# Altium schematic sheet Sheet2.SchDoc
size A2; DrawnBy: Sergiy_83
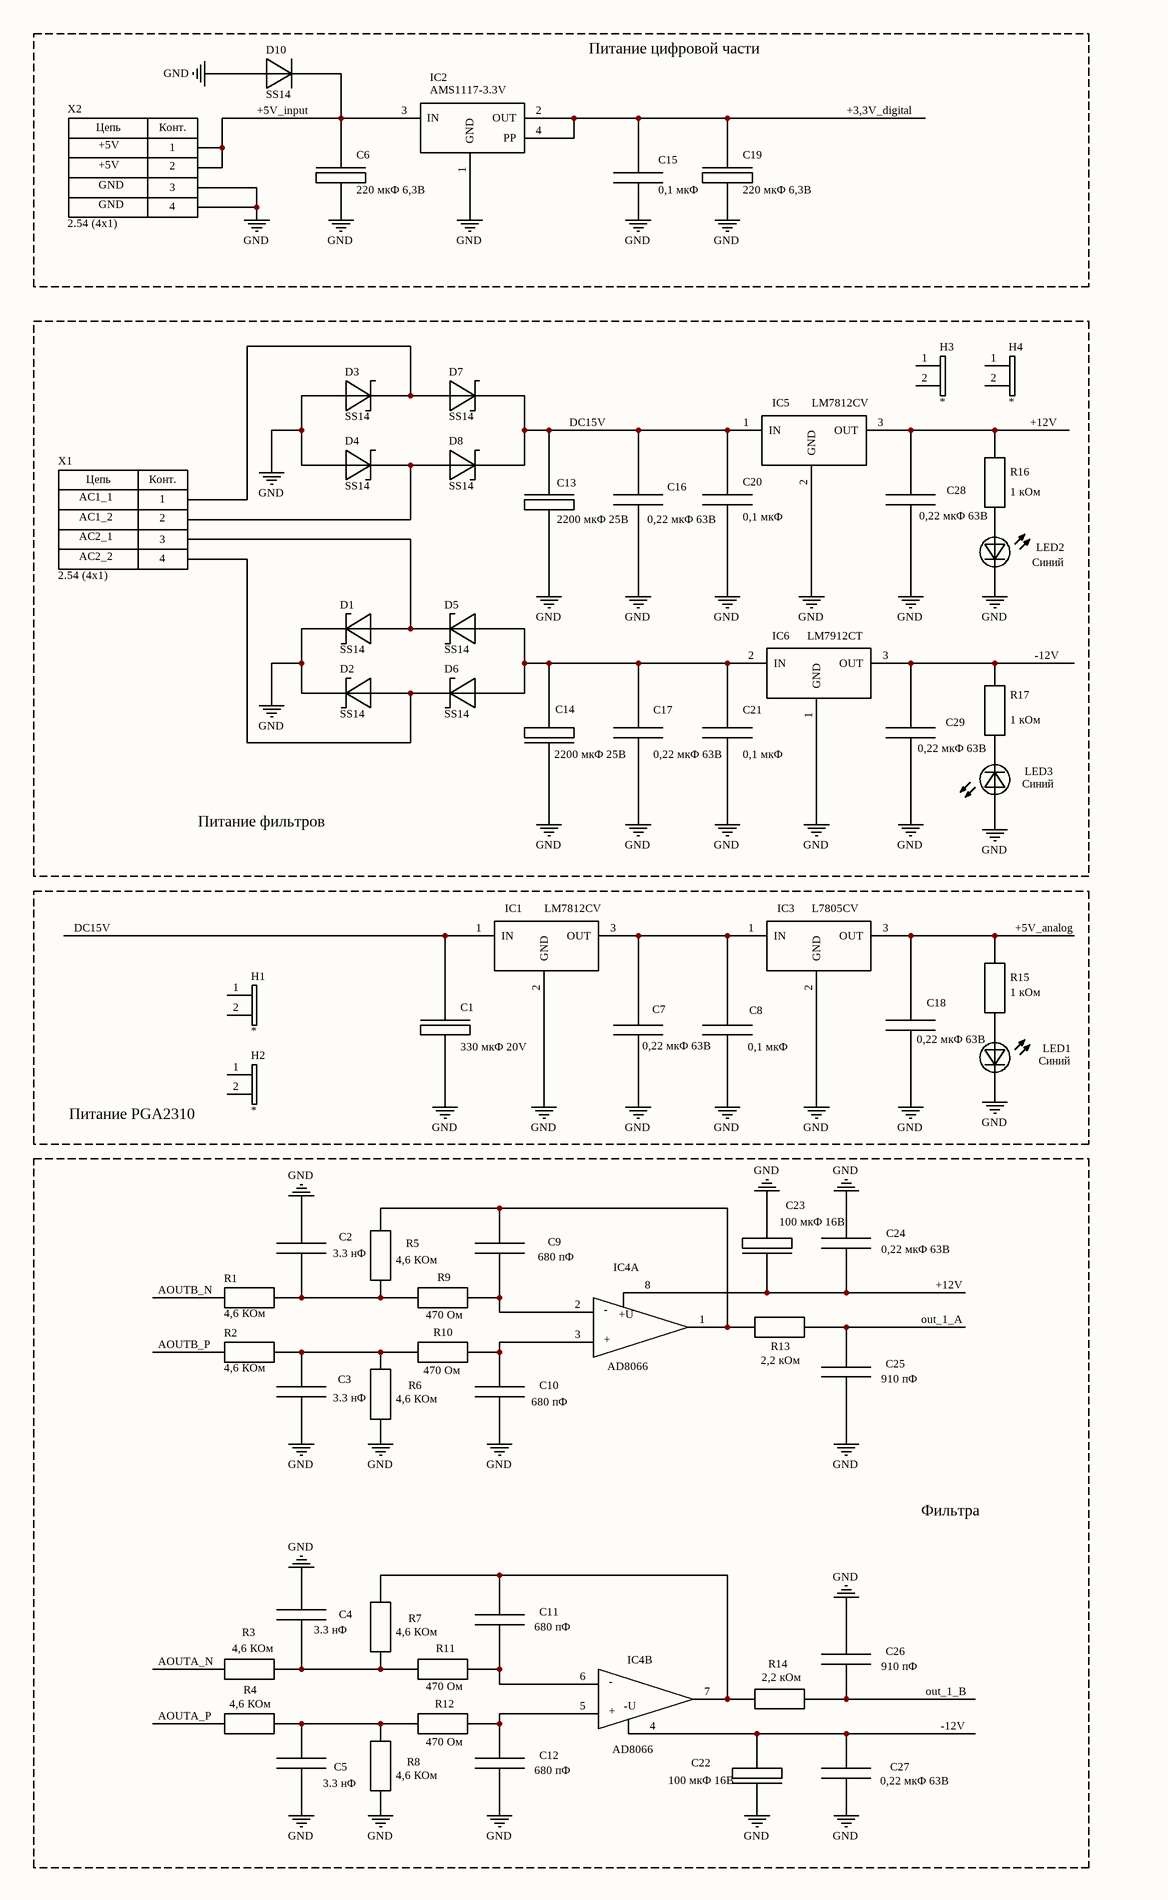
[diagram p0: Sheet2.SchDoc, left]
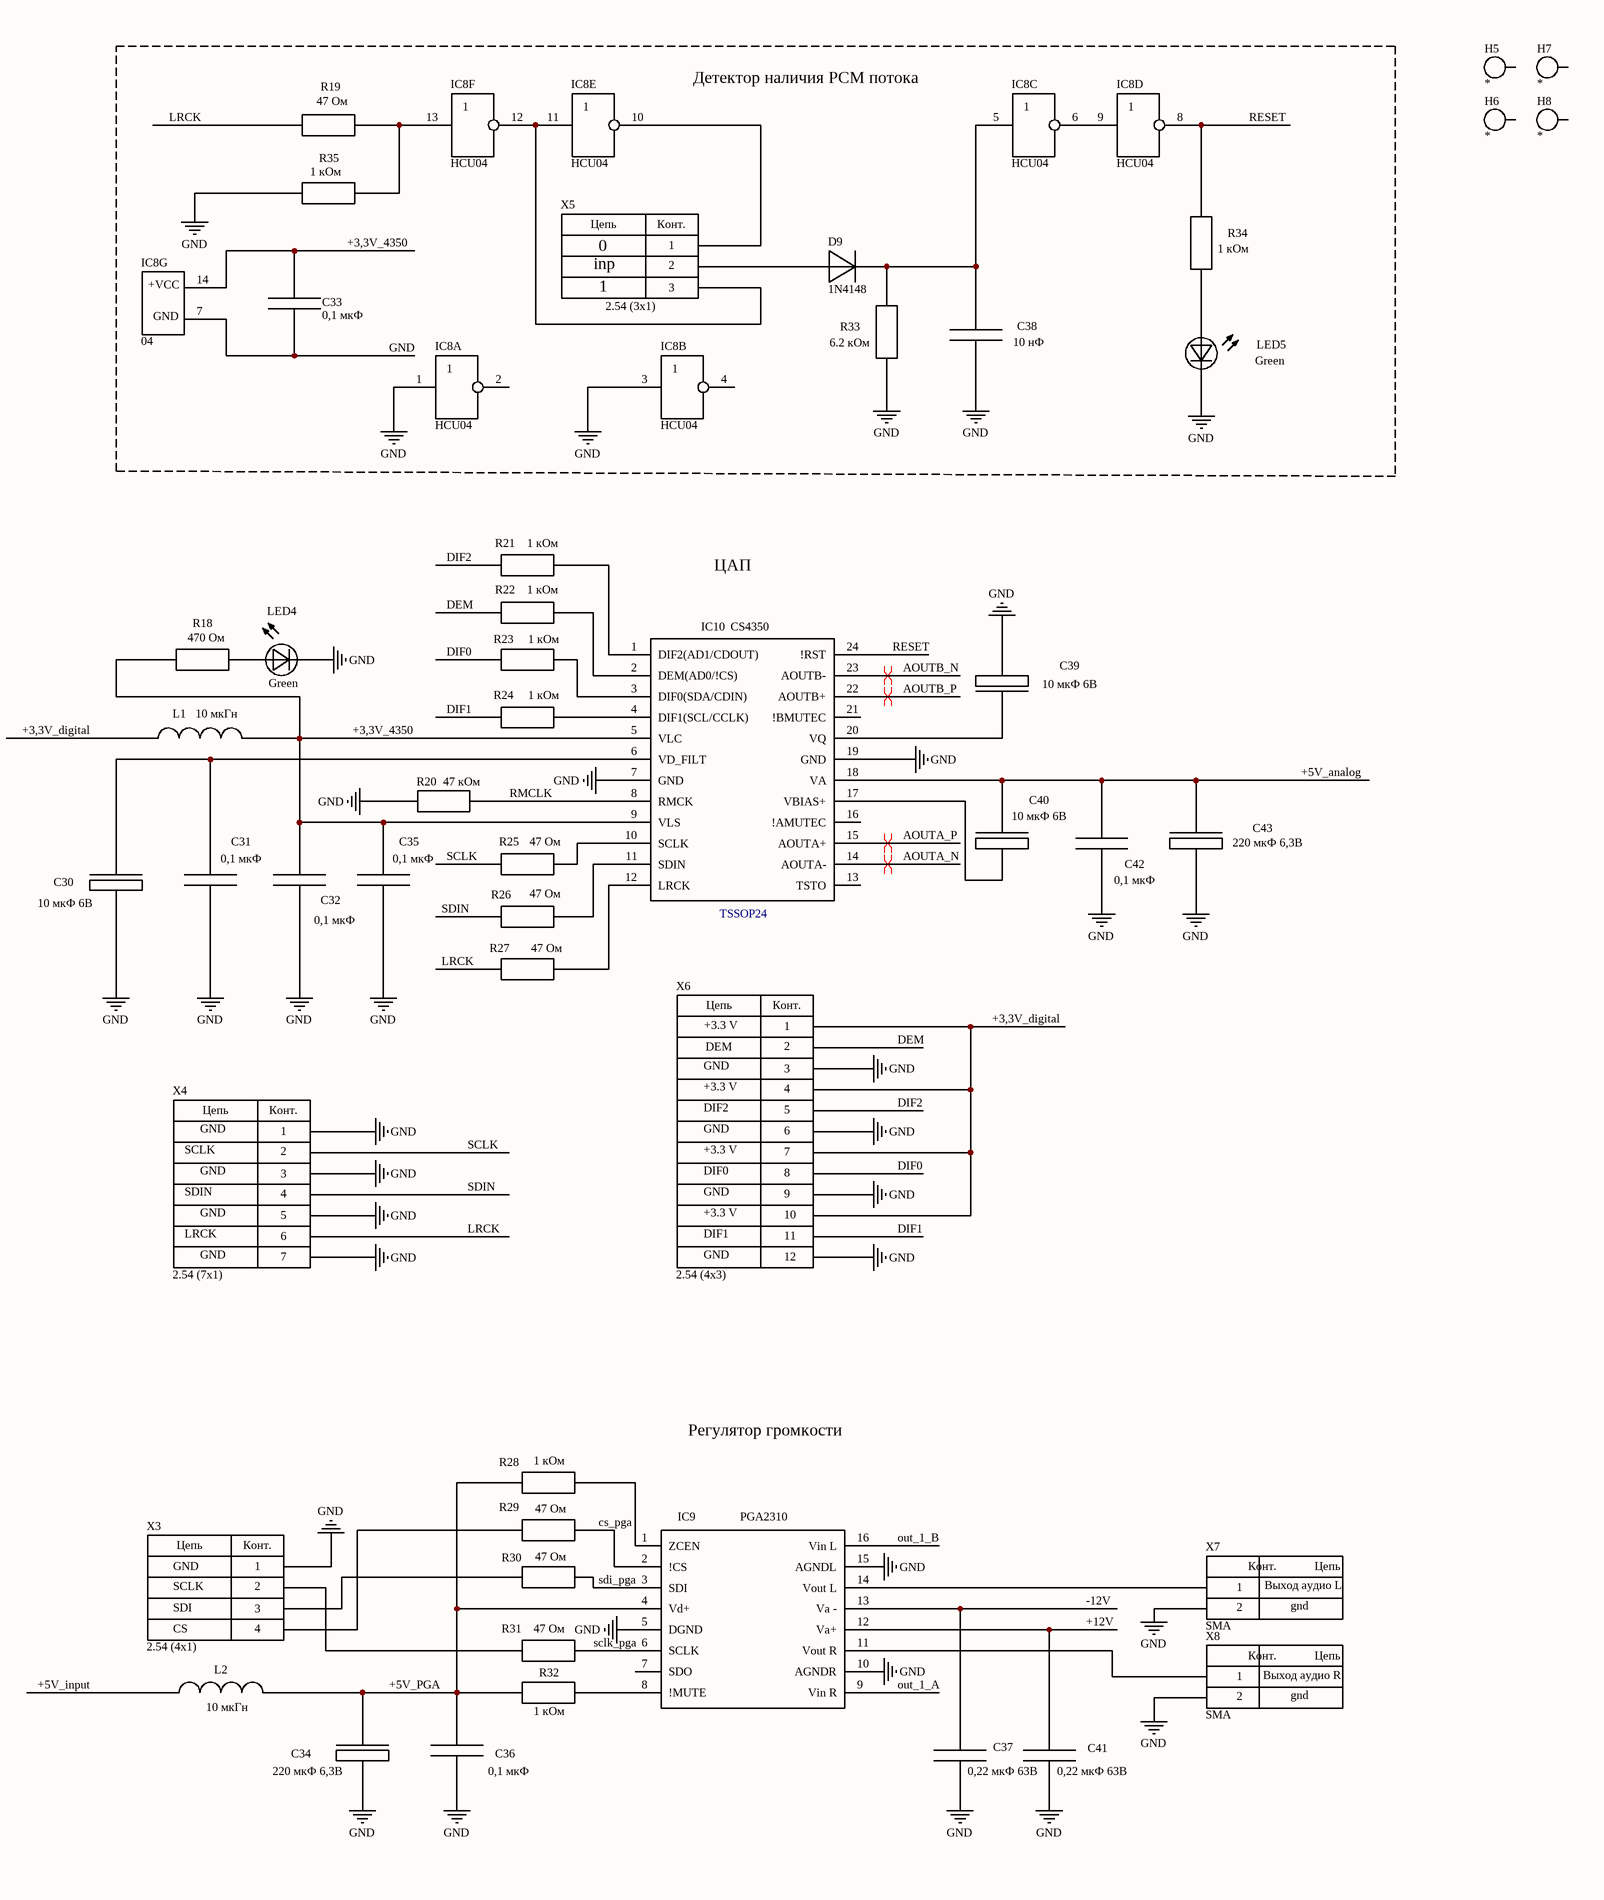
[diagram p1: Sheet2.SchDoc, right]

## Parts
C1  330 мкФ 20V  [Конденсатор D=8 H=11.5]
C2  3.3 нФ  [Конденсатор WIMA 4.5x7x5]
C3  3.3 нФ  [Конденсатор WIMA 4.5x7x5]
C4  3.3 нФ  [Конденсатор WIMA 4.5x7x5]
C5  3.3 нФ  [Конденсатор WIMA 4.5x7x5]
C6  220 мкФ 6,3В  [Конденсатор SMD Case Size D]
C7  0,22 мкФ 63В  [Конденсатор WIMA 3x7x7]
C8  0,1 мкФ  [Конденсатор SMD Case 1206]
C9  680 пФ  [Конденсатор WIMA 4.5x7x5]
C10  680 пФ  [Конденсатор WIMA 4.5x7x5]
C11  680 пФ  [Конденсатор WIMA 4.5x7x5]
C12  680 пФ  [Конденсатор WIMA 4.5x7x5]
C13  2200 мкФ 25В  [Конденсатор D=13 H=25]
C14  2200 мкФ 25В  [Конденсатор D=13 H=25]
C15  0,1 мкФ  [Конденсатор SMD Case 1206]
C16  0,22 мкФ 63В  [Конденсатор WIMA 3x7x7]
C17  0,22 мкФ 63В  [Конденсатор WIMA 3x7x7]
C18  0,22 мкФ 63В  [Конденсатор WIMA 3x7x7]
C19  220 мкФ 6,3В  [Конденсатор SMD Case Size D]
C20  0,1 мкФ  [Конденсатор SMD Case 1206]
C21  0,1 мкФ  [Конденсатор SMD Case 1206]
C22  100 мкФ 16В  [Конденсатор SMD Case Size D]
C23  100 мкФ 16В  [Конденсатор SMD Case Size D]
C24  0,22 мкФ 63В  [Конденсатор WIMA 3x7x7]
C25  910 пФ  [Конденсатор WIMA 4.5x7x5]
C26  910 пФ  [Конденсатор WIMA 4.5x7x5]
C27  0,22 мкФ 63В  [Конденсатор WIMA 3x7x7]
C28  0,22 мкФ 63В  [Конденсатор WIMA 3x7x7]
C29  0,22 мкФ 63В  [Конденсатор WIMA 3x7x7]
C30  10 мкФ 6В  [Конденсатор SMD Case Size B]
C31  0,1 мкФ  [Конденсатор SMD Case 1206]
C32  0,1 мкФ  [Конденсатор SMD Case 1206]
C33  0,1 мкФ  [Конденсатор SMD Case 1206]
C34  220 мкФ 6,3В  [Конденсатор SMD Case Size D]
C35  0,1 мкФ  [Конденсатор SMD Case 1206]
C36  0,1 мкФ  [Конденсатор SMD Case 1206]
C37  0,22 мкФ 63В  [Конденсатор WIMA 3x7x7]
C38  10 нФ  [Конденсатор SMD Case 1206]
C39  10 мкФ 6В  [Конденсатор SMD Case Size B]
C40  10 мкФ 6В  [Конденсатор SMD Case Size B]
C41  0,22 мкФ 63В  [Конденсатор WIMA 3x7x7]
C42  0,1 мкФ  [Конденсатор SMD Case 1206]
C43  220 мкФ 6,3В  [Конденсатор SMD Case Size D]
D1  SS14  [Диод SS14]
D2  SS14  [Диод SS14]
D3  SS14  [Диод SS14]
D4  SS14  [Диод SS14]
D5  SS14  [Диод SS14]
D6  SS14  [Диод SS14]
D7  SS14  [Диод SS14]
D8  SS14  [Диод SS14]
D9  1N4148  [SMD 1206 Диод]
D10  SS14  [Диод SS14]
H1  *  [Радиатор 02 (YA25)]
H2  *  [Радиатор 02 (YA25)]
H3  *  [Радиатор 02 (YA25)]
H4  *  [Радиатор 02 (YA25)]
H5  *  [Отверстие 3,2]
H6  *  [Отверстие 3,2]
H7  *  [Отверстие 3,2]
H8  *  [Отверстие 3,2]
IC1  LM7812CV  [TO-220]
IC2  AMS1117-3.3V  [SOT-223]
IC3  L7805CV  [TO-220]
IC4  AD8066  [SO-8]  (parts A,B of 2)
IC5  LM7812CV  [TO-220]
IC6  LM7912CT  [TO-220]
IC8  HCU04  [SOIC-14]  (parts A,B,C,D,E,F,G of 7)
IC9  PGA2310  [SOIC-16_2]
IC10  CS4350  [TSSOP24]
L1  10 мкГн  [SMD 1206 Индуктивность]
L2  10 мкГн  [SMD 1206 Индуктивность]
LED1  Синий  [SMD 1206 Светодиод ВАЙТ]
LED2  Синий  [SMD 1206 Светодиод ВАЙТ]
LED3  Синий  [SMD 1206 Светодиод ВАЙТ]
LED4  Green  [SMD 1206 Светодиод ВАЙТ]
LED5  Green  [SMD 1206 Светодиод ВАЙТ]
R1  4,6 КОм  [SMD 1206 Резистор]
R2  4,6 КОм  [SMD 1206 Резистор]
R3  4,6 КОм  [SMD 1206 Резистор]
R4  4,6 КОм  [SMD 1206 Резистор]
R5  4,6 КОм  [SMD 1206 Резистор]
R6  4,6 КОм  [SMD 1206 Резистор]
R7  4,6 КОм  [SMD 1206 Резистор]
R8  4,6 КОм  [SMD 1206 Резистор]
R9  470 Ом  [SMD 1206 Резистор]
R10  470 Ом  [SMD 1206 Резистор]
R11  470 Ом  [SMD 1206 Резистор]
R12  470 Ом  [SMD 1206 Резистор]
R13  2,2 кОм  [Резистор МЛТ 0,125-0,25Вт]
R14  2,2 кОм  [Резистор МЛТ 0,125-0,25Вт]
R15  1 кОм  [SMD 1206 Резистор]
R16  1 кОм  [SMD 1206 Резистор]
R17  1 кОм  [SMD 1206 Резистор]
R18  470 Ом  [SMD 1206 Резистор]
R19  47 Ом  [SMD 1206 Резистор]
R20  47 кОм  [SMD 1206 Резистор]
R21  1 кОм  [SMD 1206 Резистор]
R22  1 кОм  [SMD 1206 Резистор]
R23  1 кОм  [SMD 1206 Резистор]
R24  1 кОм  [SMD 1206 Резистор]
R25  47 Ом  [SMD 1206 Резистор]
R26  47 Ом  [SMD 1206 Резистор]
R27  47 Ом  [SMD 1206 Резистор]
R28  1 кОм  [SMD 1206 Резистор]
R29  47 Ом  [SMD 1206 Резистор]
R30  47 Ом  [SMD 1206 Резистор]
R31  47 Ом  [SMD 1206 Резистор]
R32  1 кОм  [SMD 1206 Резистор]
R33  6.2 кОм  [SMD 1206 Резистор]
R34  1 кОм  [SMD 1206 Резистор]
R35  1 кОм  [SMD 1206 Резистор]
X1  2.54 (4x1)  [terminal block 3.81mm 4way]
X2  2.54 (4x1)  [(1x4)PIN 2.54 HEADR]
X3  2.54 (4x1)  [(1x4)PIN 2.54 HEADR]
X4  2.54 (7x1)  [(1x7) PIN 2.54 HEADER]
X5  2.54 (3x1)  [(1x3)PIN 2.54 header]
X6  2.54 (4x3)  [(3X4)pin 2.54 HEADER]
X7  SMA  [SMA_01]
X8  SMA  [SMA_01]

## Blocks framed on the sheet
Питание цифровой части: C6 C15 C19 D10 IC2 X2
Питание фильтров: C13 C14 C16 C17 C20 C21 C28 C29 D1-D8 H3 H4 IC5 IC6 LED2 LED3 R16 R17 X1
Питание PGA2310: C1 C7 C8 C18 H1 H2 IC1 IC3 LED1 R15
Фильтра: C2-C5 C9-C12 C22-C27 IC4 R1-R14

## Nets
GND: C1.2 C2.1(+) C3.2(-) C4.1(+) C5.2(-) C6.2 C7.2(-) C8.2(-) C10.2(-) C12.2(-) C13.2 C14.1 C15.2(-) C16.2(-) C17.2(-) C18.2(-) C19.2 C20.2(-) C21.2(-) C22.1 C23.2 C24.2(-) C25.2(-) C26.1(+) C27.2(-) C28.2(-) C29.2(-) C30.2 C31.2(-) C32.2(-) C33.2(-) C34.2 C35.2(-) C36.2(-) C37.2(-) C38.2(-) C39.2 C41.2(-) C42.2(-) C43.2 D1.2(K) D2.2(K) D3.1(А) D4.1(А) D10.1(А) IC1.2(GND) IC2.1(GND) IC3.2(GND) IC5.2(GND) IC6.1(GND) IC8.1(pin_1) IC8.3(pin_1) IC8.7(pin_2) IC9.5(DGND) IC9.10(AGNDR) IC9.15(AGNDL) IC10.7(GND) IC10.19(GND) LED1.2(K) LED2.2(K) LED3.1(А) LED4.2(K) LED5.2(K) R6.1(left) R8.1(left) R20.1(left) R33.1(left) R35.2(right) X2.3 X2.4 X3.1 X4.1 X4.3 X4.5 X4.7 X6.3 X6.6 X6.9 X6.12 X7.2 X8.2
+3,3V_4350: C32.1(+) C33.1(+) C35.1(+) IC8.14(pin_1) IC10.5(VLC) IC10.9(VLS) L1.2 R18.2(right)
+3,3V_digital: C15.1(+) C19.1 IC2.2(OUT) IC2.4(PP) L1.1 X6.1 X6.4 X6.7 X6.10
+5V_analog: C18.1(+) C40.1 C42.1(+) C43.1 IC3.3(OUT) IC10.18(VA) R15.2(right)
+5V_input: C6.1 D10.2(K) IC2.3(IN) L2.1 X2.1 X2.2
+5V_PGA: C34.1 C36.1(+) IC9.4(Vd+) L2.2 R28.1(left) R32.1(left)
+12V: C23.1 C24.1(+) C28.1(+) C41.1(+) IC4.8(pin_8) IC5.3(OUT) IC9.12(Va+) R16.2(right)
-12V: C22.2 C27.1(+) C29.1(+) C37.1(+) IC4.4(pin_4) IC6.3(OUT) IC9.13(Va_-) R17.2(right)
AOUTA_N: IC10.14(AOUTA-) R3.1(left)
AOUTA_P: IC10.15(AOUTA+) R4.1(left)
AOUTB_N: IC10.23(AOUTB-) R1.1(left)
AOUTB_P: IC10.22(AOUTB+) R2.1(left)
cs_pga: IC9.2(!CS) R29.2(right)
DC15V: C1.1 C13.1 C16.1(+) C20.1(+) D7.2(K) D8.2(K) IC1.1(IN) IC5.1(IN)
DEM: R22.1(left) X6.2
DIF0: R23.1(left) X6.8
DIF1: R24.1(left) X6.11
DIF2: R21.1(left) X6.5
LRCK: R19.2(right) R27.1(left) X4.6
out_1_A: C25.1(+) IC9.9(Vin_R) R13.2(right)
out_1_B: C26.2(-) IC9.16(Vin_L) R14.2(right)
RESET: IC8.8(pin_2) IC10.24(!RST) R34.2(right)
RMCLK: IC10.8(RMCK) R20.2(right)
SCLK: R25.1(left) X4.2
sclk_pga: IC9.6(SCLK) R31.2(right)
sdi_pga: IC9.3(SDI) R30.2(right)
SDIN: R26.1(left) X4.4
NetC2_2: C2.2(-) R1.2(right) R5.1(left) R9.1(left)
NetC3_1: C3.1(+) R2.2(right) R6.2(right) R10.1(left)
NetC4_2: C4.2(-) R3.2(right) R7.1(left) R11.1(left)
NetC5_1: C5.1(+) R4.2(right) R8.2(right) R12.1(left)
NetC7_1: C7.1(+) C8.1(+) IC1.3(OUT) IC3.1(IN)
NetC9_1: C9.1(+) IC4.1(pin_1) R5.2(right) R13.1(left)
NetC9_2: C9.2(-) IC4.2(pin_2) R9.2(right)
NetC10_1: C10.1(+) IC4.3(pin_3) R10.2(right)
NetC11_1: C11.1(+) IC4.7(pin_7) R7.2(right) R14.1(left)
NetC11_2: C11.2(-) IC4.6(pin_6) R11.2(right)
NetC12_1: C12.1(+) IC4.5(pin_5) R12.2(right)
NetC14_2: C14.2 C17.1(+) C21.1(+) D5.1(А) D6.1(А) IC6.2(IN)
NetC30_1: C30.1 C31.1(+) IC10.6(VD_FILT)
NetC38_1: C38.1(+) D9.2(K) IC8.5(pin_1) R33.2(right)
NetC39_1: C39.1 IC10.20(VQ)
NetC40_2: C40.2 IC10.17(VBIAS+)
NetD1_1: D1.1(А) D5.2(K) X1.3
NetD2_1: D2.1(А) D6.2(K) X1.4
NetD3_2: D3.2(K) D7.1(А) X1.1
NetD4_2: D4.2(K) D8.1(А) X1.2
NetD9_1: D9.1(А) X5.2
NetIC8_6: IC8.6(pin_2) IC8.9(pin_1)
NetIC8_10: IC8.10(pin_2) X5.1
NetIC8_11: IC8.11(pin_1) IC8.12(pin_2) X5.3
NetIC8_13: IC8.13(pin_1) R19.1(left) R35.1(left)
NetIC9_1: IC9.1(ZCEN) R28.2(right)
NetIC9_8: IC9.8(!MUTE) R32.2(right)
NetIC9_11: IC9.11(Vout_R) X8.1
NetIC9_14: IC9.14(Vout_L) X7.1
NetIC10_1: IC10.1(DIF2(AD1/CDOUT)) R21.2(right)
NetIC10_2: IC10.2(DEM(AD0/!CS)) R22.2(right)
NetIC10_3: IC10.3(DIF0(SDA/CDIN)) R23.2(right)
NetIC10_4: IC10.4(DIF1(SCL/CCLK)) R24.2(right)
NetIC10_10: IC10.10(SCLK) R25.2(right)
NetIC10_11: IC10.11(SDIN) R26.2(right)
NetIC10_12: IC10.12(LRCK) R27.2(right)
NetLED1_1: LED1.1(А) R15.1(left)
NetLED2_1: LED2.1(А) R16.1(left)
NetLED3_2: LED3.2(K) R17.1(left)
NetLED4_1: LED4.1(А) R18.1(left)
NetLED5_1: LED5.1(А) R34.1(left)
NetR29_1: R29.1(left) X3.4
NetR30_1: R30.1(left) X3.3
NetR31_1: R31.1(left) X3.2

Not connected (* = marked no-connect by the designer): H1 1 2(1); H2 1 2(1); H3 1 2(1); H4 1 2(1); H5 1; H6 1; H7 1; H8 1; IC8 2(pin_2) 4(pin_2); IC9 7(SDO); IC10 13(TSTO) 16(!AMUTEC) 21(!BMUTEC)

## Layout directives
differential pair: AOUTA_N, AOUTA_P, AOUTB_N, AOUTB_P

## Notes on the sheet
- Детектор наличия PCM потока
- +5V
- GND
- 0
- inp
- 1
- AC1_1
- AC1_2
- AC2_1
- AC2_2
- ЦАП
- +3.3 V
- DEM
- DIF2
- SCLK
- SDIN
- DIF0
- LRCK
- DIF1
- Регулятор громкости
- Выход аудио L
- SDI
- CS
- gnd
- Выход аудио R
- (in symbol (1x3)pin 2.54 Header) Цепь; Конт.
- (in symbol (1x4)pin 2.54 Header) Цепь; Конт.
- (in symbol (1x7) pin 2.54 Header) Цепь; Конт.
- (in symbol (3x4)pin 2.54 Header) Цепь; Конт.
- (in symbol AD8066, part A) -; +U; +
- (in symbol AD8066, part B) -; -U; +
- (in symbol IN74AC04D, part G) +VCC; GND
- (in symbol SMA_01) Конт.; Цепь
- (in symbol Terminal block 3.81mm 4way) Цепь; Конт.

## Library data of the parts
C1-C43 = Конденсатор
  C1: Value: 330 мкФ 20V; Case: 8x15
  C2-C5: Value: 3.3 нФ; Case: 4.5x7x5
  C6 C19 C34 C43: Value: 220 мкФ 6,3В; Case: SMD Size D
  C7 C16-C18 C24 C27-C29 C37 C41: Value: 0,22 мкФ 63В; Case: 3x7x7
  C8 C15 C20 C21 C31-C33 C35 C36 C42: Value: 0,1 мкФ; Case: SMD 1206
  C9-C12: Value: 680 пФ; Case: 4.5x7x5
  C13 C14: Value: 2200 мкФ 25В; Case: 13x25
  C22 C23: Value: 100 мкФ 16В; Case: SMD Size D
  C25 C26: Value: 910 пФ; Case: 4.5x7x5
  C30 C39 C40: Value: 10 мкФ 6В; Case: SMD Size B
  C38: Value: 10 нФ; Case: SMD 1206
D1-D10 = Диод
  D1-D8 D10: Value: SS14; Case: SMA/DO-214AC
  D9: Value: 1N4148; Case: SMD 1206
H1-H4 = Радиатор: Value: *; Case: *
H5-H8 = Отверстие монтажное: Value: *
IC1 IC3 IC5 = LM7805: Case: TO-220
  IC1 IC5: Value: LM7812CV
  IC3: Value: L7805CV
IC2 = AMS1117: Value: AMS1117-3.3V; Case: SOT-223-4
IC6 = LM7905: Value: LM7912CT; Case: TO220
IC8 = IN74AC04D: Value: HCU04; Case: SOIC-14
IC9 = PGA2310UA: Value: PGA2310; Case: SOIC-16
L1 L2 = Inductor 10uH (100): Value: 10 мкГн; Case: SMD 1206
LED1-LED5 = Светодиод: Case: SMD 1206
  LED1-LED3: Value: Синий
  LED4 LED5: Value: Green
R1-R35 = Резистор: HelpURL: *; Model: *; Manufacture: *
  R1-R8: Case: MELF 0204; Value: 4,6 КОм
  R9-R12: Case: MELF 0204; Value: 470 Ом
  R13 R14: Case: 0,125 Вт; Value: 2,2 кОм
  R15-R17 R21-R24 R28 R32 R34 R35: Case: SMD 1206; Value: 1 кОм
  R18: Case: SMD 1206; Value: 470 Ом
  R19 R25-R27 R29-R31: Case: SMD 1206; Value: 47 Ом
  R20: Case: SMD 1206; Value: 47 кОм
  R33: Case: SMD 1206; Value: 6.2 кОм
X1 = Terminal block 3.81mm 4way: Value: 2.54 (4x1); Case: 2.54 папа
X2 X3 = (1x4)pin 2.54 Header: Value: 2.54 (4x1); Case: 2.54 папа
X4 = (1x7) pin 2.54 Header: Value: 2.54 (7x1); Case: 2.54 папа
X5 = (1x3)pin 2.54 Header: Value: 2.54 (3x1); Case: 2.54 папа
X6 = (3x4)pin 2.54 Header: Value: 2.54 (4x3); Case: 2.54 папа
X7 X8 = SMA_01: Value: SMA; Case: SMA мама
IC4 = AD8066: Value: AD8066; Case: SOIC-14
IC10 = CS4350: Value: CS4350; Case: TSSOP24